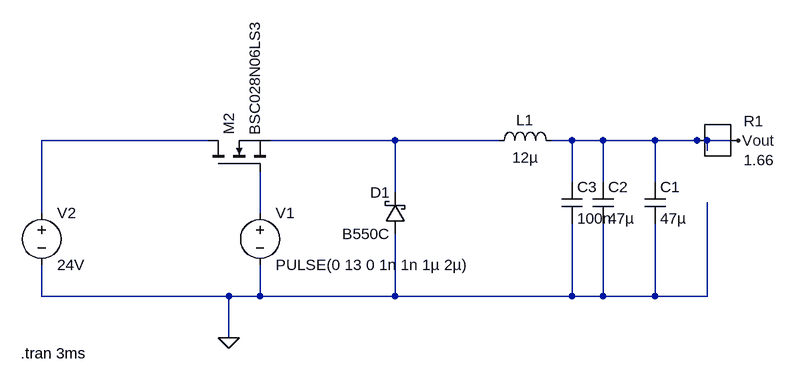
[diagram p0: schematic StepDown24_5V.asc]
StepDown24_5V.asc, the LTspice schematic file:
Version 4
SHEET 1 880 680
WIRE -240 64 -496 64
WIRE 48 64 -144 64
WIRE 208 64 48 64
WIRE 320 64 288 64
WIRE 368 64 320 64
WIRE 448 64 368 64
WIRE 528 64 448 64
WIRE 576 64 528 64
WIRE 528 80 528 64
WIRE 320 128 320 64
WIRE 368 128 368 64
WIRE 448 128 448 64
WIRE 48 144 48 64
WIRE -496 176 -496 64
WIRE -160 176 -160 112
WIRE -496 304 -496 256
WIRE -208 304 -496 304
WIRE -160 304 -160 256
WIRE -160 304 -208 304
WIRE 48 304 48 208
WIRE 48 304 -160 304
WIRE 320 304 320 192
WIRE 320 304 48 304
WIRE 368 304 368 192
WIRE 368 304 320 304
WIRE 448 304 448 192
WIRE 448 304 368 304
WIRE 528 304 528 160
WIRE 528 304 448 304
WIRE -208 368 -208 304
FLAG -208 368 0
FLAG 576 64 Vout
SYMBOL schottky 64 208 R180
WINDOW 0 24 64 Left 2
WINDOW 3 24 0 Left 2
SYMATTR InstName D1
SYMATTR Value B550C
SYMBOL ind 192 80 R270
WINDOW 0 32 56 VTop 2
WINDOW 3 5 56 VBottom 2
SYMATTR InstName L1
SYMATTR Value 12µ
SYMBOL cap 432 128 R0
SYMATTR InstName C1
SYMATTR Value 47µ
SYMBOL voltage -160 160 R0
WINDOW 123 0 0 Left 0
WINDOW 39 0 0 Left 0
SYMATTR InstName V1
SYMATTR Value PULSE(0 13 0 1n 1n 1µ 2µ)
SYMBOL voltage -496 160 R0
WINDOW 123 0 0 Left 0
WINDOW 39 0 0 Left 0
SYMATTR InstName V2
SYMATTR Value 24V
SYMBOL nmos -240 112 R270
SYMATTR InstName M2
SYMATTR Value BSC028N06LS3
SYMBOL R 512 64 R0
SYMATTR InstName R1
SYMATTR Value 1.66
SYMBOL cap 352 128 R0
SYMATTR InstName C2
SYMATTR Value 47µ
SYMBOL cap 304 128 R0
SYMATTR InstName C3
SYMATTR Value 100n
TEXT -528 392 Left 2 !.tran 3ms

The netlist it stands for:
* StepDown24_5V.asc
D1 0 N002 B550C
L1 N002 Vout 12µ
C1 Vout 0 47µ
V1 N003 0 PULSE(0 13 0 1n 1n 1µ 2µ)
V2 N001 0 24V
M2 N001 N003 N002 N002 BSC028N06LS3
R1 Vout Vout 1.66
C2 Vout 0 47µ
C3 Vout 0 100n
.model D D
.lib standard.dio
.model NMOS NMOS
.model PMOS PMOS
.lib standard.mos
.tran 3ms
.backanno
.end